# Altium schematic sheet 17_I2C&SPI&SATA.SCHDOC: Apalis Evaluation Board 1.1
size A3; Organization: Toradex AG; Address1: Altsagenstrasse 5; Address2: Horw; Address3: 6048; Address4: Switzerland; DocumentNumber: 16; Revision: V1.1; SheetNumber: 16; SheetTotal: 32; PageSetup: Record=PageOptions|CenterHorizontal=True|CenterVertical=True|PrintScale=0.73|XCorrection=1.00|YCorrection=1.00|PrintKind=0|BorderSize=5000000|LeftOffset=0|BottomOffset=0|Orientation=2|PaperLength=1000|PaperWidth=1000|Scale=100|PaperSource=7|PrintQuality=-4|MediaType=1|DitherType=10|PaperKind=A4|PrintScaleMode=1
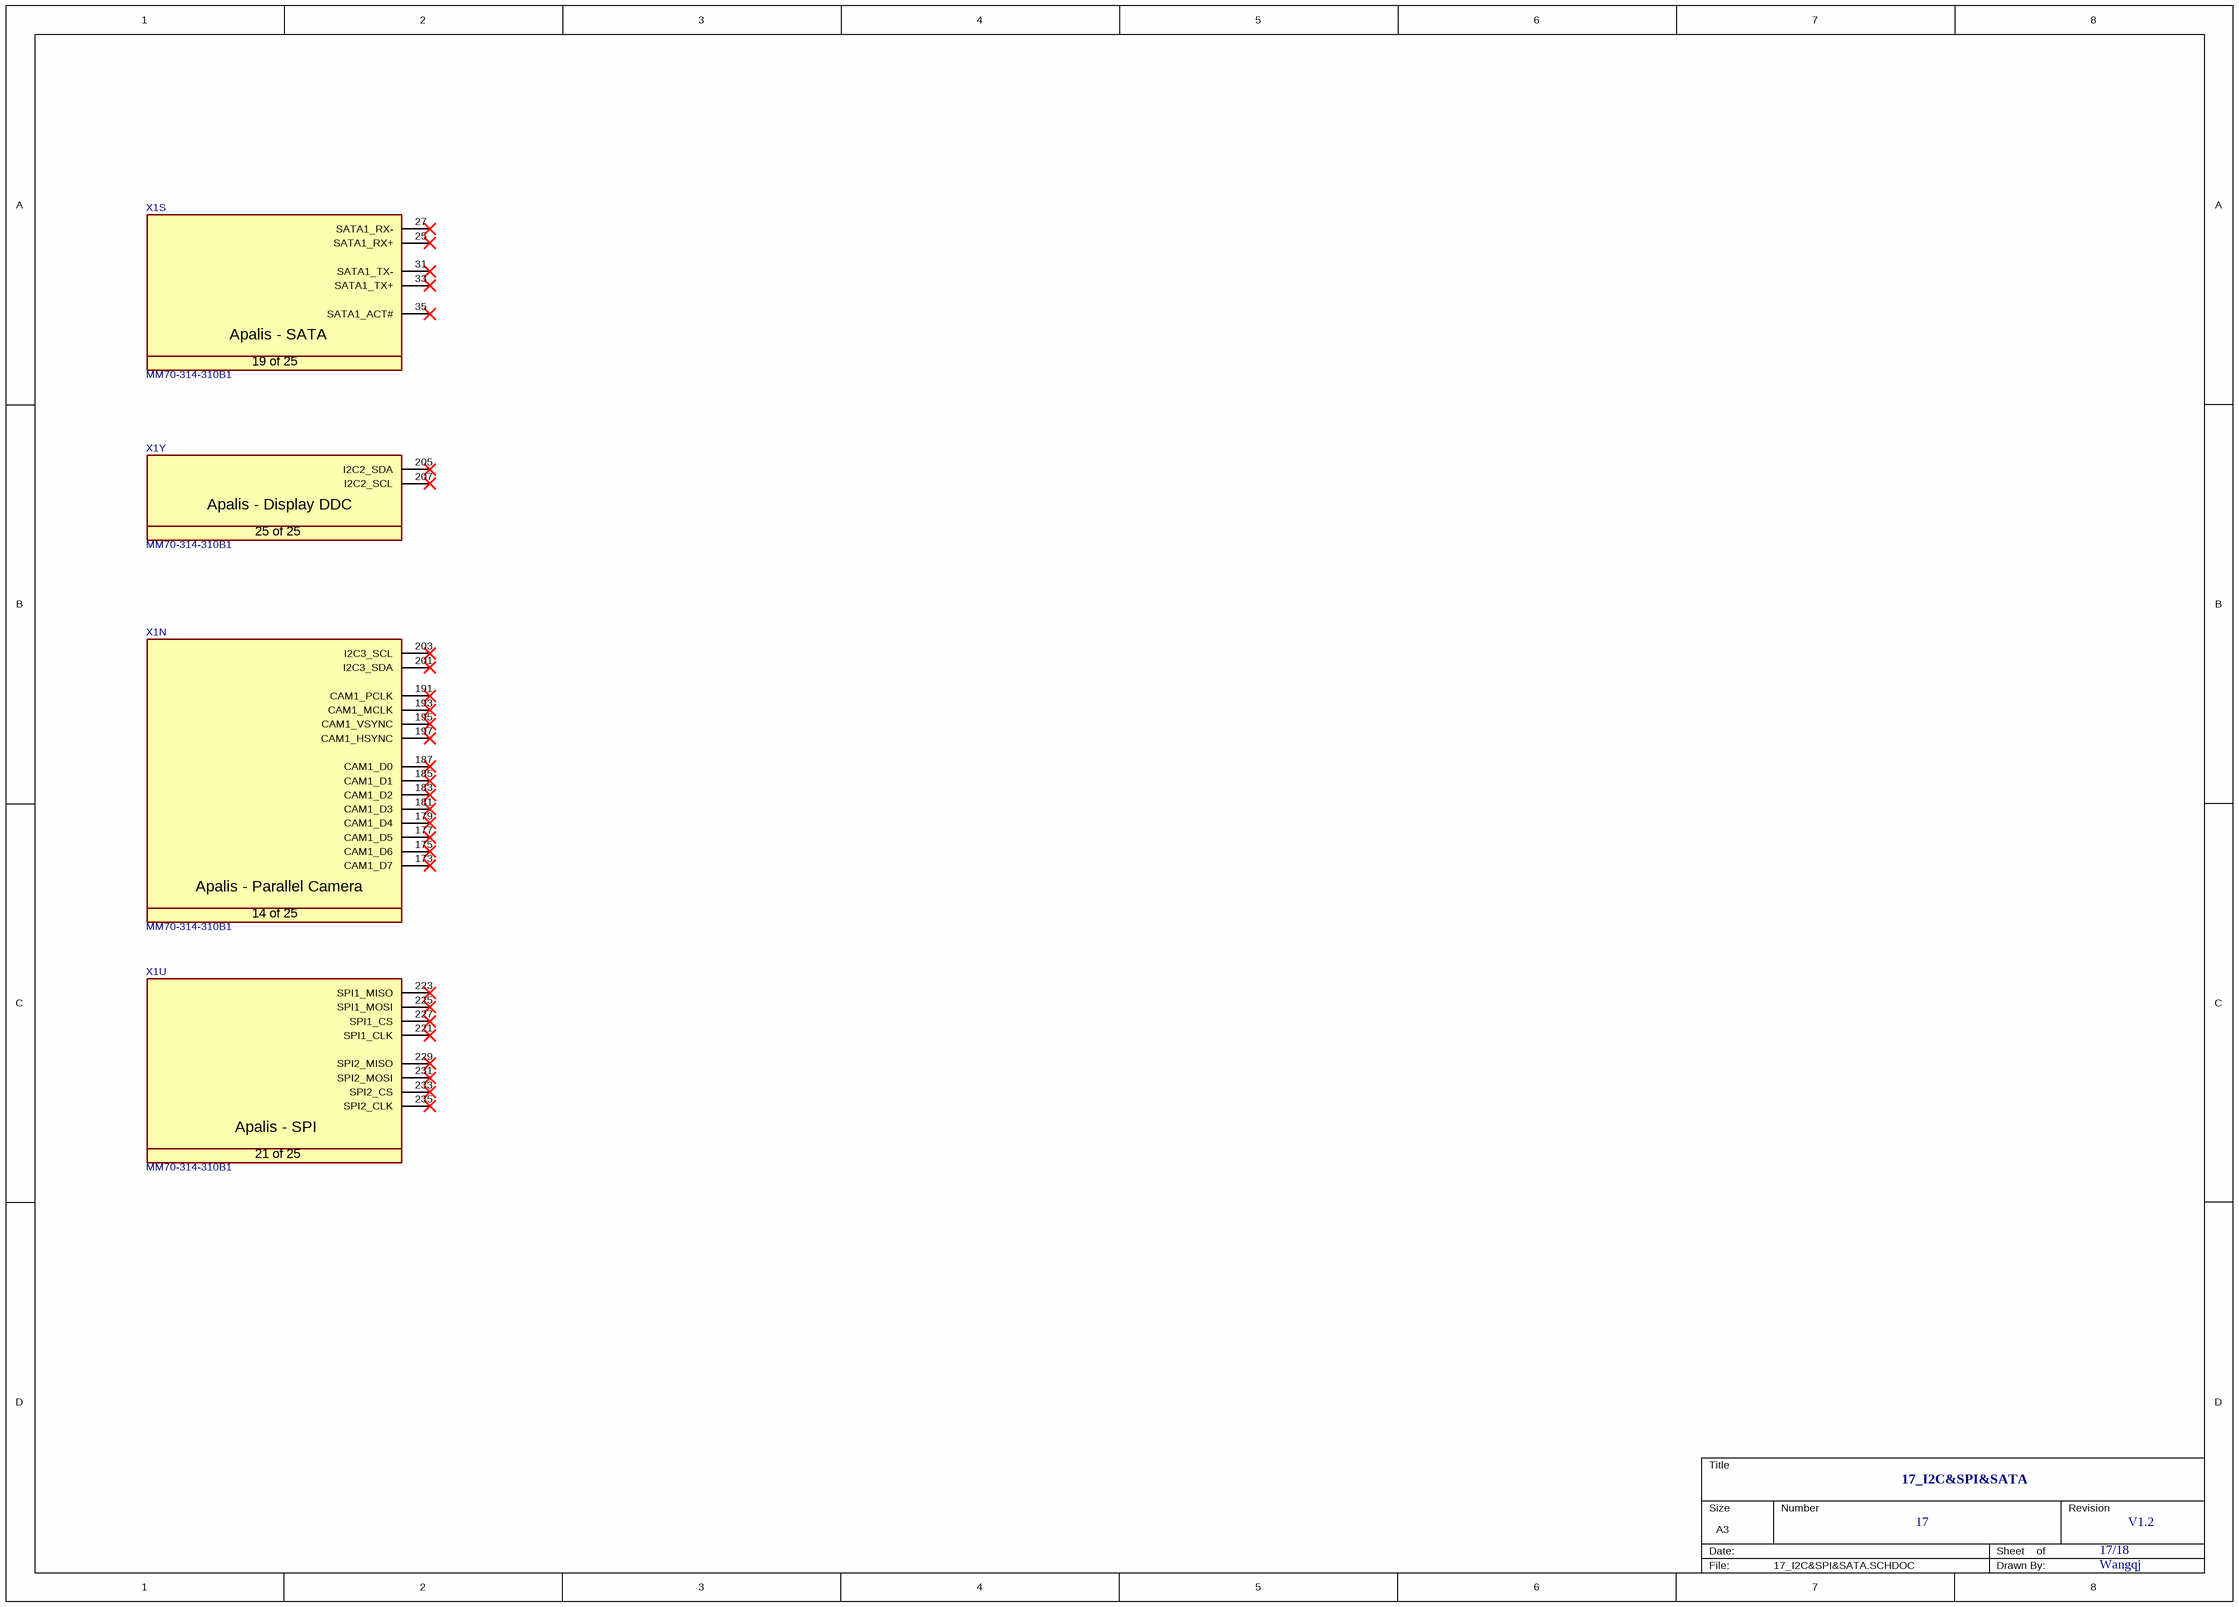
[diagram p0: 17_I2C&SPI&SATA.SCHDOC]

## Parts
X1  Manufacturer Part No.: MM70-314-310B1  [T_JAE_MM70-314-310B1]  (hidden comment: CON-JAE-MM70-314-310B1-314-0.5mm)  (parts N,S,U,Y of 25)

## Nets

Not connected (* = marked no-connect by the designer): X1 25(SATA1_RX+)* 27(SATA1_RX-)* 31(SATA1_TX-)* 33(SATA1_TX+)* 35(SATA1_ACT#)* 173(CAM1_D7)* 175(CAM1_D6)* 177(CAM1_D5)* 179(CAM1_D4)* 181(CAM1_D3)* 183(CAM1_D2)* 185(CAM1_D1)* 187(CAM1_D0)* 191(CAM1_PCLK)* 193(CAM1_MCLK)* 195(CAM1_VSYNC)* 197(CAM1_HSYNC)* 201(I2C3_SDA)* 203(I2C3_SCL)* 205(I2C2_SDA)* 207(I2C2_SCL)* 221(SPI1_CLK)* 223(SPI1_MISO)* 225(SPI1_MOSI)* 227(SPI1_CS)* 229(SPI2_MISO)* 231(SPI2_MOSI)* 233(SPI2_CS)* 235(SPI2_CLK)*

## Notes on the sheet
- 17_I2C&SPI&SATA
- 17
- 17/18
- V1.2
- Wangqj
- Title
- Size:
- Date:
- A3
- Number:
- Time:
- Revision:
- Sheet
- of
- File:
- (in symbol CON-JAE-MM70-314-310B1-314-0.5mm, part N) Apalis - Parallel Camera; 14 of 25
- (in symbol CON-JAE-MM70-314-310B1-314-0.5mm, part S) Apalis - SATA; 19 of 25
- (in symbol CON-JAE-MM70-314-310B1-314-0.5mm, part U) Apalis - SPI; 21 of 25
- (in symbol CON-JAE-MM70-314-310B1-314-0.5mm, part Y) Apalis - Display DDC; 25 of 25

## Library data of the parts
X1 = CON-JAE-MM70-314-310B1-314-0.5mm: MXM3 Connector; Manufacturer Name: JAE; No. of ways: 314